# EAGLE design Pulchra_02 (EAGLE 9.6.2)
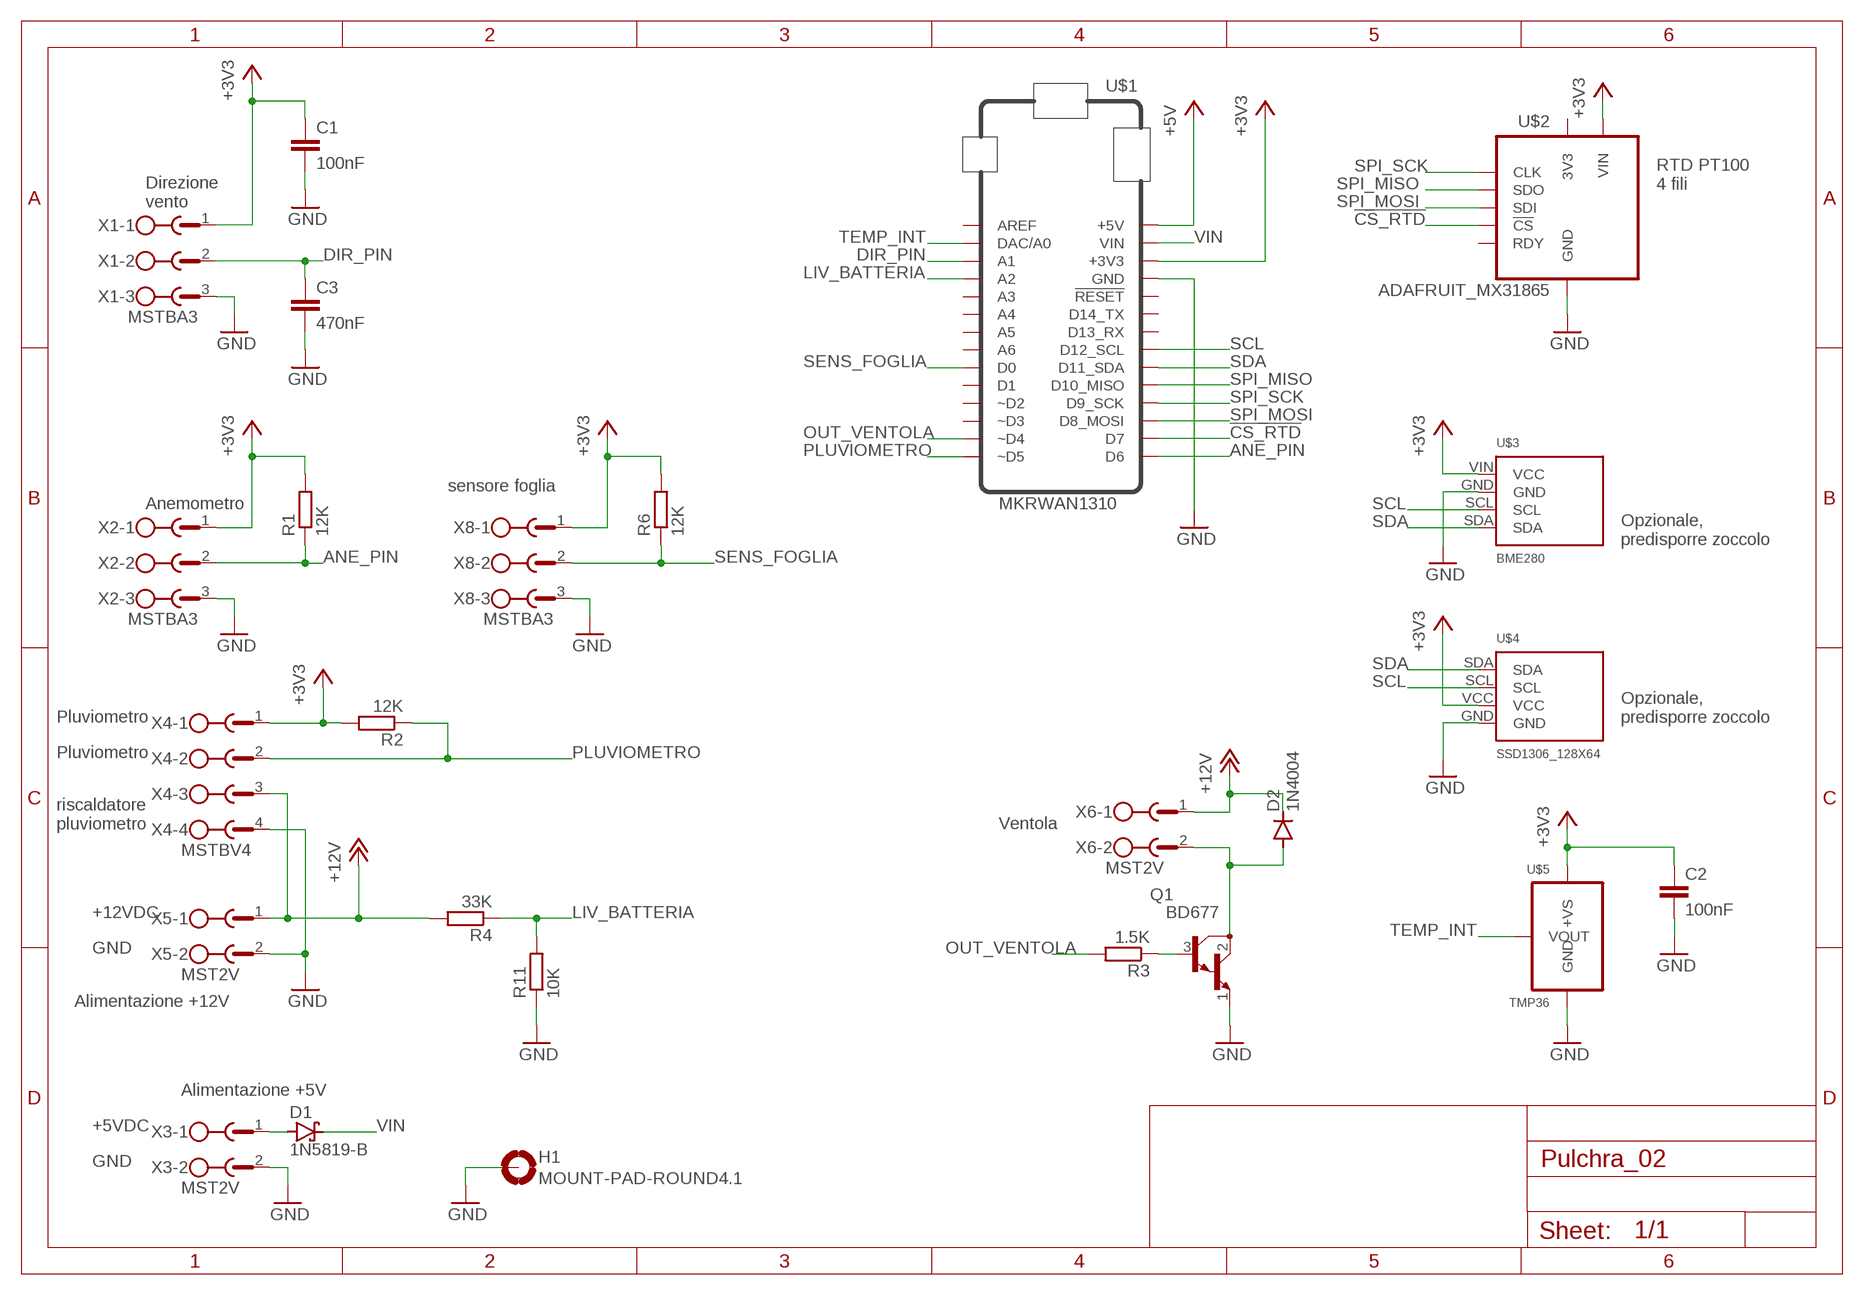
[diagram p0: schematic, sheet 1]

## Parts
C1  100nF  C-EU050-025X075  [C050-025X075]
C2  100nF  C-EU050-025X075  [C050-025X075]
C3  470nF  C-EU050-025X075  [C050-025X075]
D1  1N5819-B  [DO41-7.6]
D2  1N4004  [DO41-10]
H1  MOUNT-PAD-ROUND4.1  [4,1-PAD]
Q1  BD677  [TO126]
R1  12K  R-EU_0207/10  [0207/10]
R2  12K  R-EU_0207/10  [0207/10]
R3  1.5K  R-EU_0207/10  [0207/10]
R4  33K  R-EU_0207/10  [0207/10]
R6  12K  R-EU_0207/10  [0207/10]
R11  10K  R-EU_0207/10  [0207/10]
U$1  MKRWAN1310  [MKRWAN1310]
U$2  ADAFRUIT_MX31865  [ADAFRUIT_MAX31865]
U$3  BME280  [BME280_GYBMEP]
U$4  SSD1306_128X64  [128X64]
U$5  TMP36  [TO92]
X1  MSTBA3  [MSTBA3]
X2  MSTBA3  [MSTBA3]
X3  MST2V  [MSTBV2]
X4  MSTBV4  [MSTBV4]
X5  MST2V  [MSTBV2]
X6  MST2V  [MSTBV2]
X8  MSTBA3  [MSTBA3]

## Nets
!CS_RTD! [digital]: U$1.D7 U$2.P7(!CS!)
+3V3 [power]: C1.1 C2.1 R1.2 R2.2 R6.2 U$1.+3V3 U$2.P1(VIN) U$3.VIN(VCC) U$4.VCC U$5.1(+VS) X1.1 X2.1 X4.1 X8.1
+5V [power]: U$1.+5V
+12V [power]: D2.C R4.2 X4.3 X5.1 X6.1
ANE_PIN [digital]: R1.1 U$1.D6 X2.2
DIR_PIN [analog]: C3.1 U$1.A1 X1.2
GND: C1.2 C2.2 C3.2 H1.B4,1(MOUNT) Q1.1(E) R11.1 U$1.GND U$2.P2(GND) U$3.GND U$4.GND U$5.3(GND) X1.3 X2.3 X3.2 X4.4 X5.2 X8.3
LIV_BATTERIA [analog]: R4.1 R11.2 U$1.A2
N$2 [digital]: Q1.3(B) R3.1
N$3 [power]: D1.A X3.1
N$4 [power]: D2.A Q1.2(C) X6.2
OUT_VENTOLA [digital]: R3.2 U$1.~D4
PLUVIOMETRO [digital]: R2.1 U$1.~D5 X4.2
SCL [digital]: U$1.D12_SCL U$3.SCL U$4.SCL
SDA [digital]: U$1.D11_SDA U$3.SDA U$4.SDA
SENS_FOGLIA [digital]: R6.1 U$1.D0 X8.2
SPI_MISO [digital]: U$1.D10_MISO U$2.P5(SDO)
SPI_MOSI [digital]: U$1.D8_MOSI U$2.P6(SDI)
SPI_SCK [digital]: U$1.D9_SCK U$2.P4(CLK)
TEMP_INT [analog]: U$1.DAC0/A0(DAC/A0) U$5.2(VOUT)
VIN [power]: D1.C U$1.VIN
Unconnected: U$1.!RESET! U$1.A3 U$1.A4 U$1.A5 U$1.A6 U$1.AREF U$1.D1 U$1.D13_RX U$1.D14_TX U$1.~D2 U$1.~D3 U$2.P3(3V3) U$2.P8(RDY)

## Notes on the sheet
- RTD PT100
  4 fili
- Direzione 
  vento
- sensore foglia
- Anemometro
- Opzionale,
  predisporre zoccolo
- Pluviometro
- Opzionale,
  predisporre zoccolo
- Pluviometro
- riscaldatore
  pluviometro
- Ventola
- +12VDC
- GND
- Alimentazione +12V
- Alimentazione +5V
- +5VDC
- GND

## Library data of the parts
C1-C3 = rcl:C-EU: CAPACITOR, European symbol; SPICEPREFIX: C
D1 = diode:1N581*: 1.0A SCHOTTKY BARRIER RECTIFIER Source: http://www.diodes.com/datasheets/ds23001.pdf
D2 = diode:1N4004: DIODE general purpose rectifier, 1 A
H1 = holes:MOUNT-PAD-ROUND: MOUNTING PAD, round
Q1 = transistor-npn:BD677*: NPN Darlington Transistor
R1-R4 R6 R11 = rcl:R-EU_: RESISTOR, European symbol; SPICEPREFIX: R
U$1 = Arduino_MKRWAN1310:MKRWAN1310: Arduino MKR WAN 1310 - Code: MKRWAN1310WANT
U$2 = Adafruit_MAX31865_RTD:ADAFRUIT_MX31865: Adafruit MAX31865 - Adafruit MAX31865 RTD PT100 or PT1000 Amplifier
U$3 = BME280:BME280
U$4 = ssd1306oled:SSD1306_128X64: OLED Display Board 0.91" 128x64 White I2C - 4 Pins - SSD1306
U$5 = tmp36:TMP36: TMP35, TMP36, TMP37 - low voltage, precision centigrade temperature sensors
X1 X2 X8 = con-phoenix-508:MSTBA3: PHOENIX; MF: FARNELL; MPN: 1757255; OC_FARNELL: 3705183; OC_NEWARK: 71C4162
X3 X5 X6 = con-phoenix-508:MST2V: PHOENIX; OC_FARNELL: unknown; OC_NEWARK: unknown
X4 = con-phoenix-508:MSTBV4: PHOENIX; MPN: MSTBV 2,5/4-GF-5.08; OC_FARNELL: 1792794; OC_NEWARK: 69R9847

## Net classes
0 default: width 0.305 mm, drill 0.762 mm, clearance 0.406 mm
1 power: width 0.889 mm, drill 0.762 mm, clearance 0.61 mm to class 0, clearance 0.762 mm
2 analog: width 0.635 mm, drill 0.762 mm, clearance 0.635 mm to class 0, clearance 0.635 mm to class 1, clearance 0.635 mm
3 digital: width 0.406 mm, drill 0.762 mm, clearance 0.406 mm to class 0, clearance 0.406 mm to class 1, clearance 0.406 mm to class 2, clearance 0.406 mm

## Board
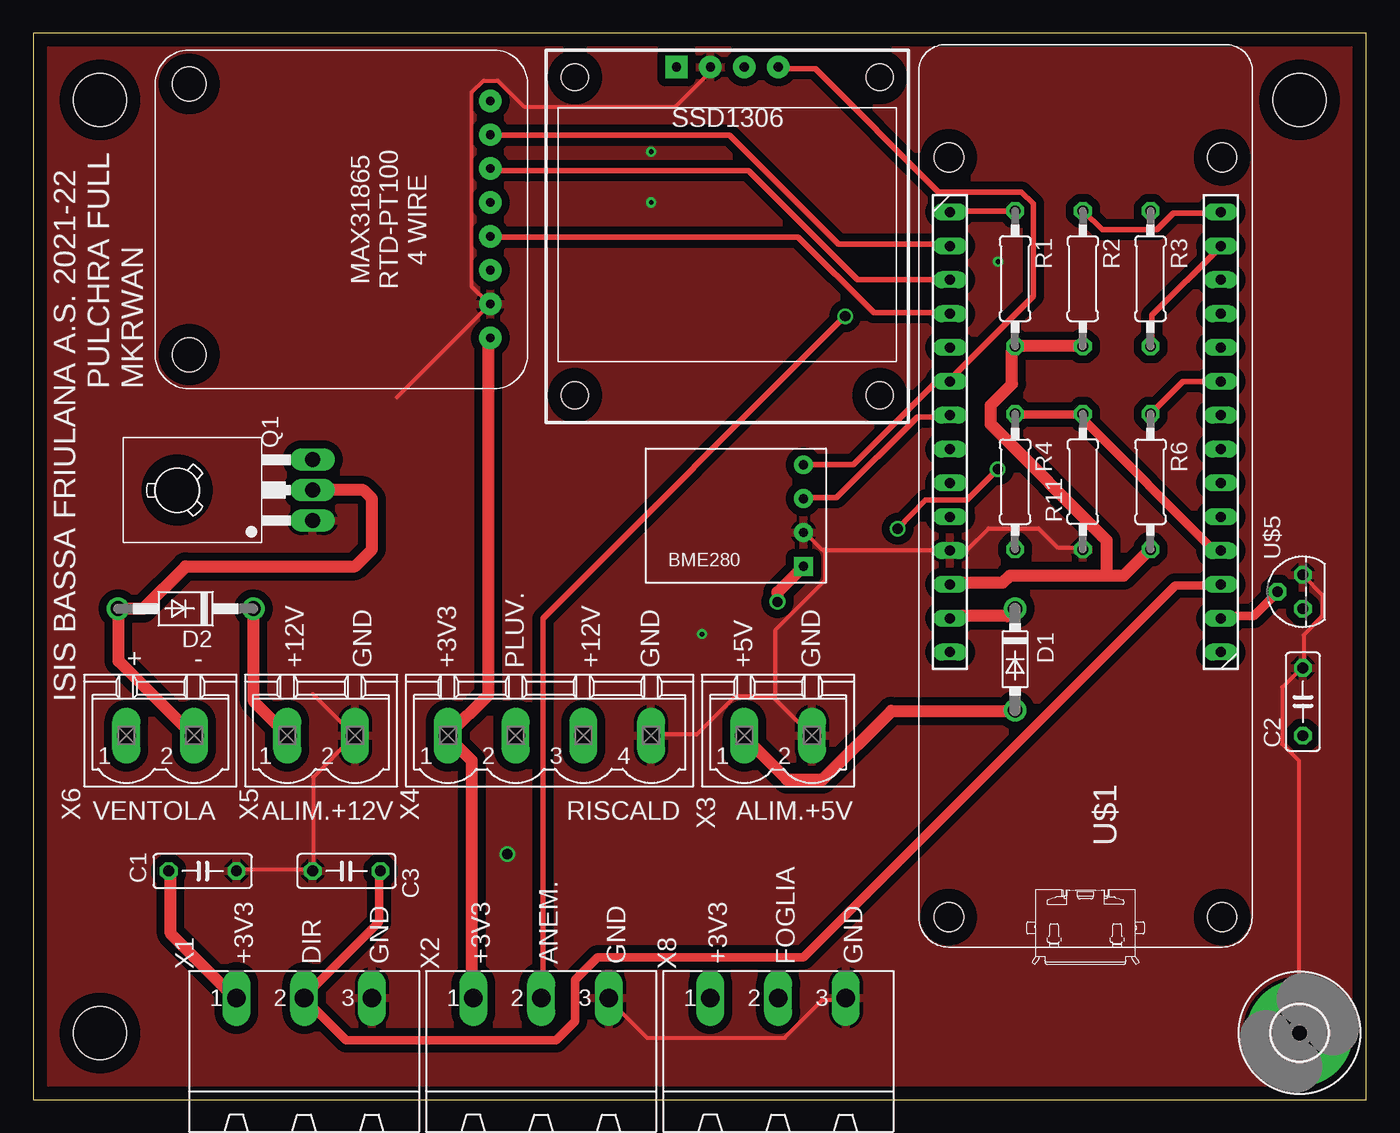
[diagram p1: board, top side]
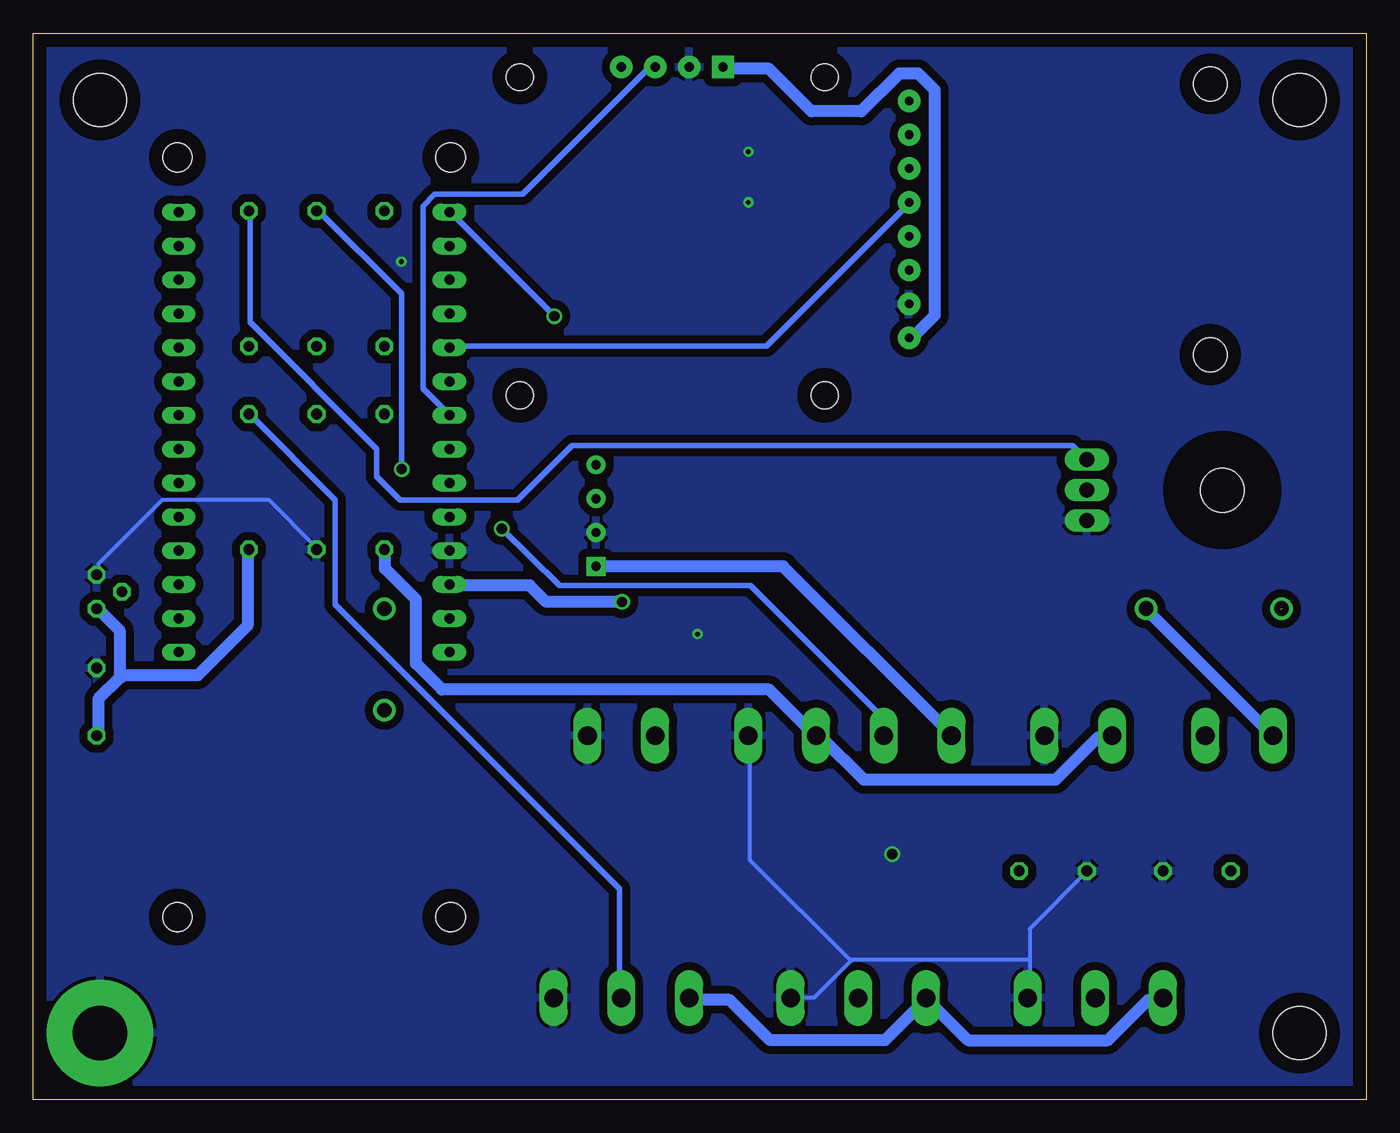
[diagram p2: board, bottom side, seen from below]

Size 100 x 80 mm. Coordinates in mm from the lower left corner, seen from the top.
Outline: 0,0 100,0 100,80 0,80 0,0
Copper layers (1*16): Top 0.035mm / dielectric 1.5mm / Bottom 0.035mm
Design rules "default": minimum track width 6mil, minimum drill 0.35mm, track to track 6mil, track to pad 6mil, pad to pad 6mil, via to via 6mil, smd to smd 6mil, copper to edge 40mil, drill to drill 6mil, minimum pad ring 10mil, minimum via ring 8mil, stop-mask expansion 4mil, vias tented up to drill 0mil, thermal gap 10mil
Holes 4 mm at 5,75 5,5 95,75
tKeepout: area -2.5,78.7 to 102.9,82.5; area -2.5,-1.3 to 102.9,1.3; area -2.5,-2.5 to 1.3,83.8; area 99.1,-2.5 to 102.9,83.8
bKeepout: area -2.5,78.7 to 102.9,82.5; area -2.5,-2.5 to 1.3,83.8; area 99.1,-1.3 to 102.9,83.8; area -2.5,-1.3 to 102.9,1.3

### Footprints (pad centres in the part's own frame; a part is rotated, then mirrored left to right if it is on the bottom)
C050-025X075 = drill 0.813 octagon: 1 -2.54,0; 2 2.54,0
DO41-7.6 = drill 1.1 pad 1.7: A 3.81,0; C -3.81,0
DO41-10 = drill 1.118: A 5.08,0; C -5.08,0
4,1-PAD = drill 4.1 pad 8: B4,1 0,0
TO126 = drill 1.118 long: 1 -2.286,-5.08; 2 0,-5.08; 3 2.286,-5.08 | hole 3.302: 0,5.08
0207/10 = drill 0.813 octagon: 1 -5.08,0; 2 5.08,0
MKRWAN1310 = drill 0.75 long: !RESET! 32.295,22.66; +3V3 27.215,22.66; +5V 22.135,22.66; A1 27.215,2.34; A2 29.755,2.34; A3 32.295,2.34; A4 34.835,2.34; A5 37.375,2.34; A6 39.915,2.34; AREF 22.135,2.34; D0 42.455,2.34; D1 44.995,2.34; D6 55.155,22.66; D7 52.615,22.66; D8_MOSI 50.075,22.66; D9_SCK 47.535,22.66; D10_MISO 44.995,22.66; D11_SDA 42.455,22.66; D12_SCL 39.915,22.66; D13_RX 37.375,22.66; D14_TX 34.835,22.66; DAC0/A0 24.675,2.34; GND 29.755,22.66; VIN 24.675,22.66; ~D2 47.535,2.34; ~D3 50.075,2.34; ~D4 52.615,2.34; ~D5 55.155,2.34 | hole 2.2: 2.25,22.75; 2.25,2.25; 59.25,22.75; 59.25,2.25
ADAFRUIT_MAX31865 = drill 0.65 pad 1.676: P1 -8.89,-10.16; P2 -6.35,-10.16; P3 -3.81,-10.16; P4 -1.27,-10.16; P5 1.27,-10.16; P6 3.81,-10.16; P7 6.35,-10.16; P8 8.89,-10.16 | hole 2.54: -10.16,12.446; 10.16,12.446
BME280_GYBMEP = drill 0.7 pad 1.422: GND 1.27,5.08; SCL -1.27,5.08; SDA -3.81,5.08 | drill 0.7 pad 1.422 square: VIN 3.81,5.08
128X64 = drill 0.7 pad 1.676: GND -1.27,12.7; SCL 1.27,12.7; SDA 3.81,12.7 | drill 0.7 pad 1.676 square: VCC -3.81,12.7 | hole 2.032: -11.43,11.938; -11.43,-11.938; 11.43,11.938; 11.43,-11.938
TO92 = drill 0.813 octagon: 1 -1.27,0; 2 0,1.905; 3 1.27,0
MSTBA3 = drill 1.397 long: 1 -5.08,5.08; 2 0,5.08; 3 5.08,5.08
MSTBV2 = drill 1.397 long: 1 -2.54,0; 2 2.54,0
MSTBV4 = drill 1.397 long: 1 -7.62,0; 2 -2.54,0; 3 2.54,0; 4 7.62,0

### Placement (x,y rotation side)
C1  12.7,17.14 0 top
C2  95.25,29.84 90 top
C3  23.5,17.14 180 top
D1  73.66,33.02 270 top
D2  11.43,36.83 180 top
H1  95,5 0 top
Q1  15.88,45.72 90 top
R1  73.66,61.59 270 top
R2  78.74,61.59 270 top
R3  83.82,61.59 270 top
R4  73.66,46.35 270 top
R6  83.82,46.35 270 top
R11  78.74,46.35 90 top
U$1  91.44,11.43 90 top
U$2  24.13,66.04 90 top
U$3  52.7,43.81 270 top
U$4  52.07,64.77 0 top
U$5  95.25,38.1 90 top
X1  20.32,2.54 0 top
X2  38.1,2.54 0 top
X3  55.88,27.3 0 top
X4  38.73,27.3 0 top
X5  21.59,27.3 0 top
X6  9.53,27.3 0 top
X8  55.88,2.54 0 top

### Tracks (layer width: path | path; a pad name or v marks a point on that pad's centre or on a via)
!CS_RTD!
  Top 0.406: U$1.D7 68.63,64.19 60.4,64.19 52.22,72.36 34.31,72.36 U$2.P7
+3V3  (via drill 0.76)
  Top 0.889: R2.2 78.59,56.54 73.79,56.54 R1.2 73.43,56.19 73.43,53.7 71.83,52.09 71.83,50.67 80.54,41.96 80.54,39.29 | 80.54,39.29 81.79,39.29 83.74,41.25 R6.2 | 80.54,39.29 73.25,39.29 72.72,38.76 68.81,38.76 U$1.+3V3 | C1.1 10.31,17.07 10.31,12.45 15.11,7.64 X1.1 | U$2.P1 34.14,57.07 34.14,30.4 31.11,27.38 X4.1 31.29,27.03 32.89,25.43 32.89,7.64 X2.1 | v55.83,37.34 55.83,38.05 U$3.VIN
  Bottom 0.889: 93.52,31.65 95.12,30.05 95.12,27.38 C2.1 | 93.52,31.65 93.52,35.2 95.12,36.8 U$5.1 | 93.52,31.65 93.17,31.83 87.66,31.83 83.92,35.56 83.92,41.25 R6.2 | U$3.VIN 43.74,40.01 31.11,27.38 X4.1 | U$4.VCC 48.18,77.34 44.81,77.34 41.6,74.14 37.87,74.14 35.03,76.99 33.6,76.99 32.36,75.74 32.36,58.85 34.14,57.07 U$2.P1 | X8.1 50.67,7.47 47.75,7.47 44.73,4.45 36.09,4.45 33.07,7.47 X2.1 32.72,7.29 29.87,4.45 19.38,4.45 16.36,7.47 15.29,7.47 X1.1 | v55.83,37.34 61.52,37.34 62.76,38.58 68.63,38.58 U$1.+3V3
+12V
  Top 0.889: D2.C 16.54,36.8 16.54,29.87 19.02,27.38 X5.1
  Bottom 0.889: X6.1 7.11,27.38 16.54,36.8 D2.C | R4.2 73.61,41.25 73.61,39.83 71.3,37.52 71.3,32.72 69.34,30.76 44.81,30.76 41.43,27.38 X4.3 40.89,27.2 37.69,24 23.29,24 20.09,27.2 19.2,27.2 X5.1
ANE_PIN  (via drill 0.76)
  Top 0.406: R1.1 68.81,66.67 U$1.D6 | v60.91,58.78 38.23,36.09 38.23,7.64 X2.2
  Bottom 0.406: v60.91,58.78 68.63,66.5 U$1.D6
DIR_PIN
  Top 0.635: U$1.A1 89.08,38.58 85.7,38.58 57.78,10.67 42.32,10.67 40.64,8.99 40.64,5.87 39.22,4.45 23.47,4.45 20.45,7.47 X1.2 20.45,7.82 25.96,13.34 25.96,17.07 C3.1
GND  (via drill 0.35, 0.76)
  Top 0.305: 55.56,30.14 58.32,27.38 X3.2 | 55.56,30.14 55.47,30.23 52.63,30.23 49.78,27.38 46.41,27.38 X4.4 | U$5.3 95.3,39.29 96.72,37.87 96.72,36.27 95.3,34.85 95.3,32.54 C2.2 95.12,32.36 93.7,30.94 93.7,26.67 94.94,25.43 94.94,5.16 H1.B4,1 | 59.38,41.25 59.21,41.25 57.78,42.67 U$3.GND | 59.38,41.25 68.63,41.25 U$1.GND 70.01,41.19 71.68,42.85 75.41,42.85 76.83,41.43 78.59,41.43 R11.1 | 59.38,41.25 59.38,38.94 55.65,35.2 55.65,30.23 55.56,30.14 | C1.2 15.29,17.25 20.8,17.25 C3.2 20.98,17.25 20.98,24.18 24,27.2 X5.2 24,27.38 20.98,30.4 | X8.3 60.81,7.47 59.21,7.47 56.36,4.62 46.05,4.62 43.2,7.47 X2.3 | 20.98,43.38 Q1.1 20.98,43.56 | 27.28,52.7 34.14,59.56 U$2.P2 34.14,59.74 32.89,60.98 32.89,75.56 33.78,76.45 34.85,76.45 36.8,74.5 48.18,74.5 50.67,76.99 50.67,77.34 U$4.GND
  Bottom 0.305: U$5.3 95.12,39.47 95.12,40.18 90.32,44.98 82.32,44.98 78.77,41.43 R11.1 | 25.25,10.49 25.25,12.8 20.98,17.07 C3.2 | 25.25,10.49 25.25,7.64 X1.3 | 38.67,10.4 38.58,10.49 25.25,10.49 | 38.67,10.4 41.43,7.64 43.03,7.64 X2.3 | 38.67,10.4 46.23,17.96 46.23,27.2 X4.4
  other vias: 46.35,71.12 72.39,62.87 46.35,67.31 50.16,34.92 35.56,18.41
  pour Top (isolate 0.61): -5.71,84.45 104.78,84.45 104.78,-3.81 -5.71,-3.81
  pour Bottom (isolate 0.61): -4.45,85.09 104.78,85.09 104.78,-2.54 -4.45,-2.54
LIV_BATTERIA
  Top 0.635: U$1.A2 89.08,41.25 88.54,41.25 78.77,51.03 78.77,51.38 R11.2 78.59,51.38 73.79,51.38 R4.1
N$2
  Bottom 0.406: R3.1 83.74,66.67 83.74,58.32 74.24,48.82 74.24,46.76 72.47,44.98 63.68,44.98 59.59,49.07 22.05,49.07 20.98,48.01 Q1.3
N$3
  Top 0.889: D1.A 73.61,29.16 64.36,29.16 59.21,24 56.54,24 53.34,27.2 X3.1
N$4  (1 unrouted)
  Top 0.889: 6.4,36.8 6.4,32.89 11.91,27.38 X6.2 | D2.A 8.26,36.83 11.43,40.01 24.13,40.01 25.4,41.27 25.4,45.09 24.77,45.72 Q1.2
OUT_VENTOLA
  Top 0.406: U$1.~D4 89.08,64.01 83.92,58.85 83.92,56.54 R3.2
PLUVIOMETRO  (via drill 0.76)
  Top 0.406: U$1.~D5 89.08,66.5 85.52,66.5 84.28,65.25 80.19,65.25 78.77,66.67 R2.1 | v64.85,42.82 66.93,44.98 70.05,44.98 v72.36,47.3
  Bottom 0.406: X4.2 36.2,28.57 46.2,38.58 60.52,38.58 64.83,42.82 v64.85,42.82 | v72.36,47.3 72.36,60.45 78.59,66.67 R2.1
SCL
  Top 0.406: U$1.D12_SCL 68.63,51.21 66.32,51.21 60.27,45.16 57.78,45.16 U$3.SCL
  Bottom 0.406: U$4.SCL 53.34,77.34 53.87,77.34 63.3,67.92 69.88,67.92 70.76,67.03 70.76,53.34 68.81,51.38 U$1.D12_SCL
SDA
  Top 0.406: U$3.SDA 57.78,47.65 61.52,47.65 67.74,53.87 68.63,53.87 U$1.D11_SDA 68.81,54.05 75.03,60.27 75.03,67.21 74.14,68.1 67.92,68.1 58.67,77.34 56.01,77.34 U$4.SDA
SENS_FOGLIA
  Top 0.406: U$1.D0 89.08,53.87 86.23,53.87 83.92,51.56 R6.1
  Bottom 0.406: X8.2 56.01,7.64 56.01,15.82 77.34,37.16 77.34,44.98 83.74,51.38 R6.1
SPI_MISO
  Bottom 0.406: U$1.D10_MISO 68.63,56.54 44.98,56.54 34.31,67.21 U$2.P5
SPI_MOSI
  Top 0.406: U$1.D8_MOSI 68.63,61.52 61.82,61.52 53.65,69.7 34.31,69.7 U$2.P6
SPI_SCK
  Top 0.406: U$1.D9_SCK 68.63,59.03 63.07,59.03 57.38,64.72 34.31,64.72 U$2.P4
TEMP_INT
  Top 0.635: U$1.DAC0/A0 89.26,36.27 91.57,36.27 93.34,38.05 U$5.2
VIN
  Top 0.889: U$1.VIN 68.81,36.27 73.08,36.27 73.61,36.8 D1.C

### Text on the board
tNames: SSD1306 | MAX31865 / RTD-PT100 / 4 WIRE | PULCHRA FULL | MKRWAN | + | - | +12V | GND | +3V3 | PLUV. | +12V | GND | +5V | GND | ISIS BASSA FRIULANA A.S. 2021-22 | VENTOLA | ALIM.+12V | RISCALD | ALIM.+5V | +3V3 | DIR | GND | +3V3 | ANEM. | GND | +3V3 | FOGLIA | GND